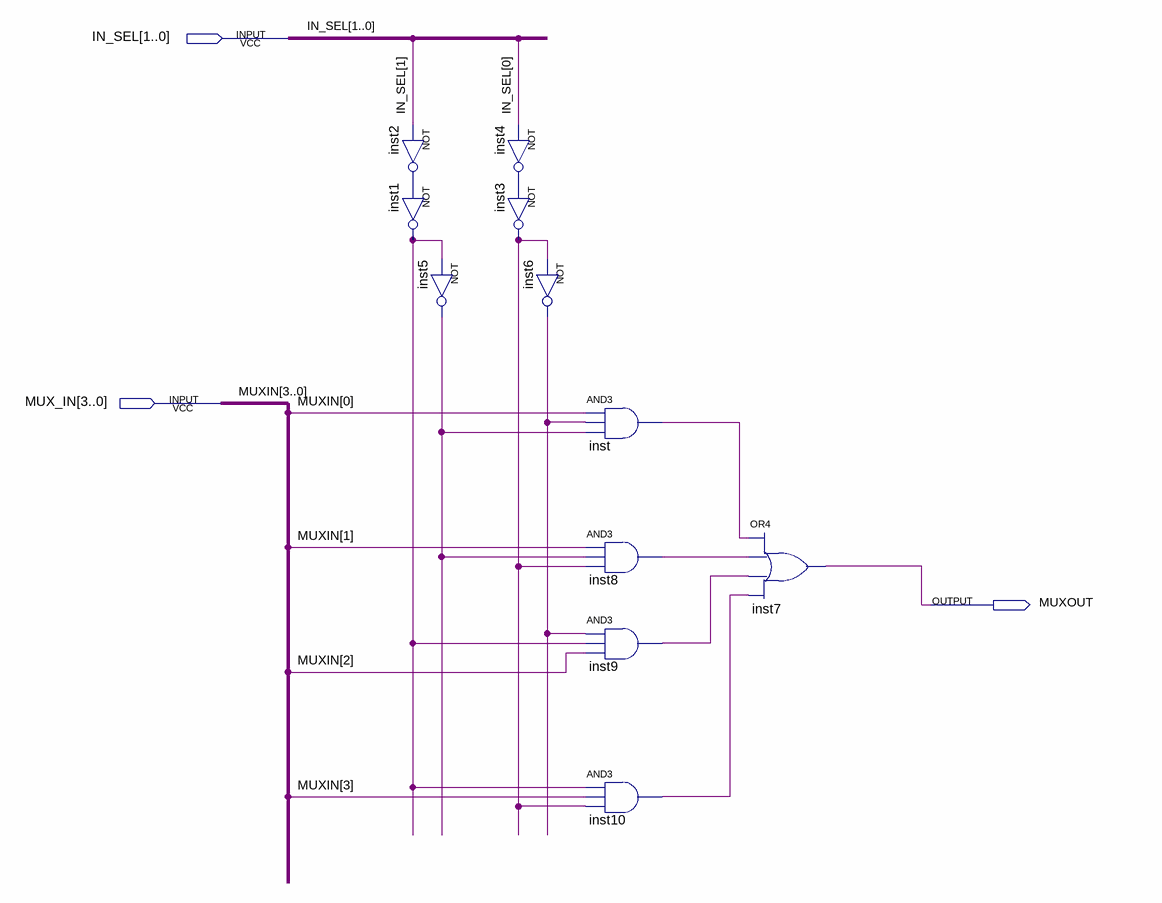
[diagram p0: schematic sheet]
// Quartus schematic 4to1Mux.bdf as structural Verilog: 11 symbols, 3 pins
module \4to1Mux  (
  input  [1:0] IN_SEL,
  input  [3:0] MUX_IN,
  output MUXOUT
);

  wire inst1_out, inst2_out, inst3_out, inst4_out, inst5_out, inst6_out, inst8_out, inst9_out, inst10_out,
       inst_out;

  not inst2 (inst2_out, IN_SEL[1]);
  not inst1 (inst1_out, inst2_out);
  not inst5 (inst5_out, inst1_out);
  not inst4 (inst4_out, IN_SEL[0]);
  not inst3 (inst3_out, inst4_out);
  not inst6 (inst6_out, inst3_out);
  and inst (inst_out, MUX_IN[0], inst6_out, inst5_out);
  and inst8 (inst8_out, MUX_IN[1], inst5_out, inst3_out);
  and inst9 (inst9_out, inst6_out, inst1_out, MUX_IN[2]);
  and inst10 (inst10_out, inst1_out, MUX_IN[3], inst3_out);
  or inst7 (MUXOUT, inst_out, inst8_out, inst9_out, inst10_out);

  // Other names for the same wires on the sheet: MUXIN[3:0] = MUX_IN
endmodule
